# EAGLE design wet_spinning_pcb_v3 (EAGLE 9.6.2)
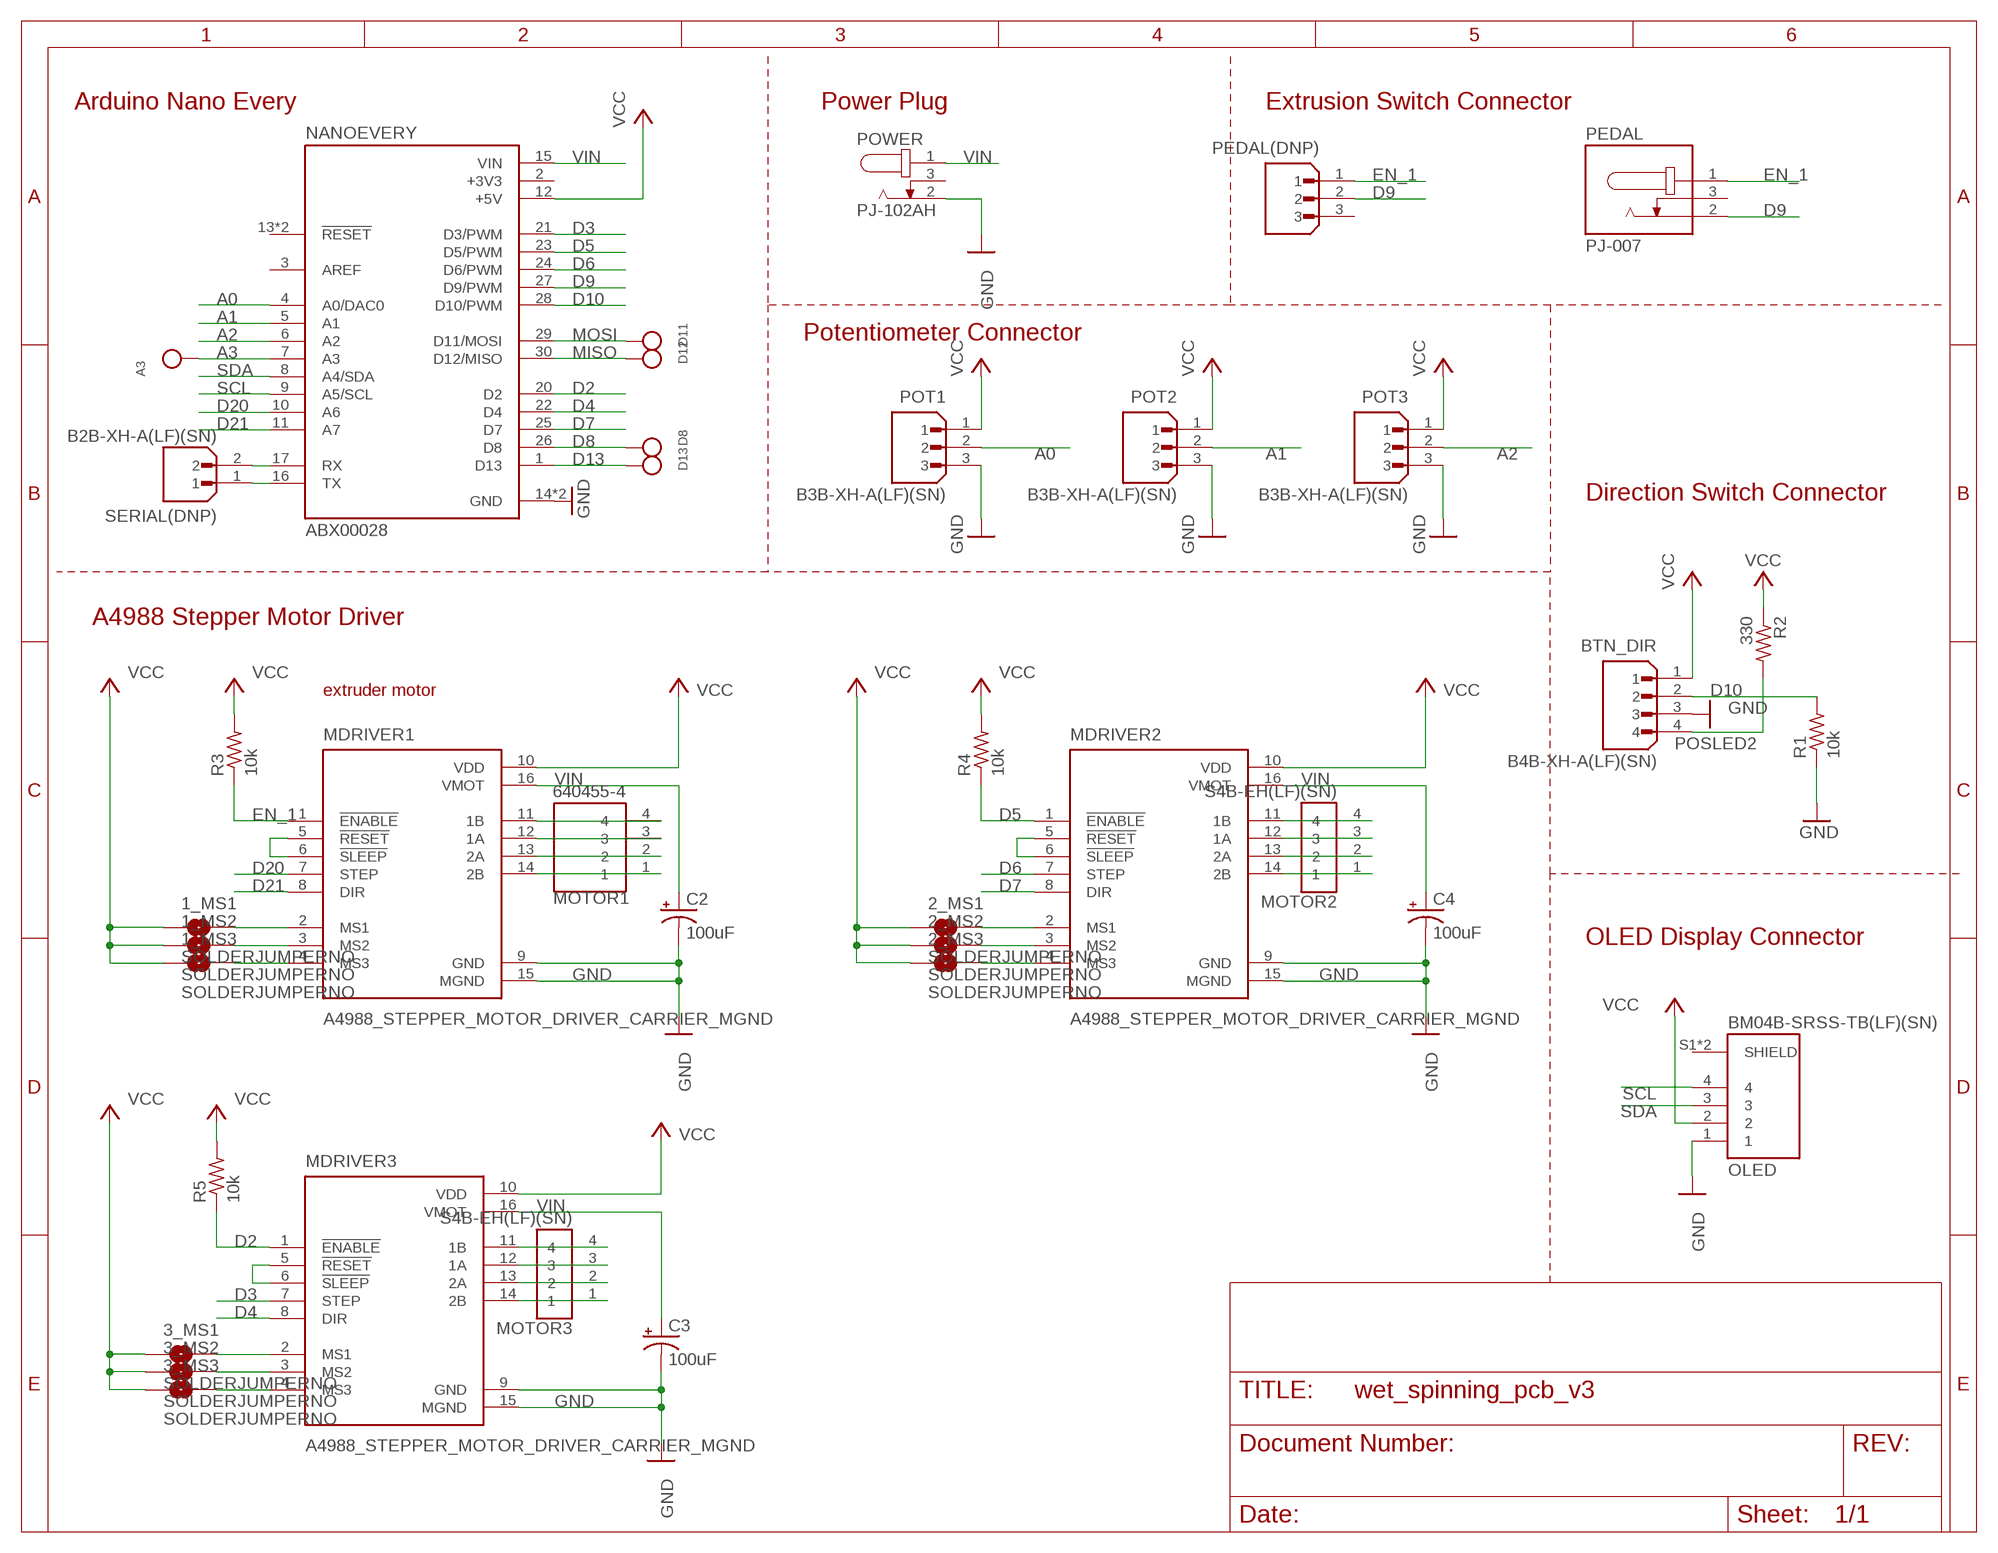
[diagram p0: schematic, sheet 1]

## Parts
1_MS1  SOLDERJUMPERNO  [SJ_2S-NO]
1_MS2  SOLDERJUMPERNO  [SJ_2S-NO]
1_MS3  SOLDERJUMPERNO  [SJ_2S-NO]
2_MS1  SOLDERJUMPERNO  [SJ_2S-NO]
2_MS2  SOLDERJUMPERNO  [SJ_2S-NO]
2_MS3  SOLDERJUMPERNO  [SJ_2S-NO]
3_MS1  SOLDERJUMPERNO  [SJ_2S-NO]
3_MS2  SOLDERJUMPERNO  [SJ_2S-NO]
3_MS3  SOLDERJUMPERNO  [SJ_2S-NO]
A3  TESTPOINT0.1"  [1X01_ROUND]
BTN_DIR  B4B-XH-A(LF)(SN)  [JST_B4B-XH-A(LF)(SN)]
C2  100uF  100UF-POLAR-RADIAL-2.5MM-25V-20%  [CPOL-RADIAL-2.5MM-6.5MM]
C3  100uF  100UF-POLAR-RADIAL-2.5MM-25V-20%  [CPOL-RADIAL-2.5MM-6.5MM]
C4  100uF  100UF-POLAR-RADIAL-2.5MM-25V-20%  [CPOL-RADIAL-2.5MM-6.5MM]
D8  TESTPOINT0.1"  [1X01_ROUND]
D11  TESTPOINT0.1"  [1X01_ROUND]
D12  TESTPOINT0.1"  [1X01_ROUND]
D13  TESTPOINT0.1"  [1X01_ROUND]
MDRIVER1  A4988_STEPPER_MOTOR_DRIVER_CARRIER_MGND  [MODULE_A4988_STEPPER_MOTOR_DRIVER_CARRIER]
MDRIVER2  A4988_STEPPER_MOTOR_DRIVER_CARRIER_MGND  [MODULE_A4988_STEPPER_MOTOR_DRIVER_CARRIER]
MDRIVER3  A4988_STEPPER_MOTOR_DRIVER_CARRIER_MGND  [MODULE_A4988_STEPPER_MOTOR_DRIVER_CARRIER]
MOTOR1  640455-4  [TE_640455-4]
MOTOR2  S4B-EH(LF)(SN)  [JST_S4B-EH(LF)(SN)]
MOTOR3  S4B-EH(LF)(SN)  [JST_S4B-EH(LF)(SN)]
NANOEVERY  ABX00028  [MODULE_ABX00028]
OLED  BM04B-SRSS-TB(LF)(SN)  [JST_BM04B-SRSS-TB(LF)(SN)]
PEDAL  PJ-007  [CUI_PJ-007]
PEDAL(DNP)  B3B-XH-A(LF)(SN)  [JST_B3B-XH-A(LF)(SN)]
POT1  B3B-XH-A(LF)(SN)  [JST_B3B-XH-A(LF)(SN)]
POT2  B3B-XH-A(LF)(SN)  [JST_B3B-XH-A(LF)(SN)]
POT3  B3B-XH-A(LF)(SN)  [JST_B3B-XH-A(LF)(SN)]
POWER  PJ-102AH  [CUI_PJ-102AH]
R1  10k  R-US_0204/7  [0204/7]
R2  330  R-US_0204/7  [0204/7]
R3  10k  R-US_0204/7  [0204/7]
R4  10k  R-US_0204/7  [0204/7]
R5  10k  R-US_0204/7  [0204/7]
SERIAL(DNP)  B2B-XH-A(LF)(SN)  [JST_B2B-XH-A(LF)(SN)]

## Nets
A0: NANOEVERY.4(A0/DAC0) POT1.2
A1: NANOEVERY.5(A1) POT2.2
A2: NANOEVERY.6(A2) POT3.2
A3: A3.1 NANOEVERY.7(A3)
D2: MDRIVER3.1(!ENABLE) NANOEVERY.20(D2) R5.1
D3: MDRIVER3.7(STEP) NANOEVERY.21(D3/PWM)
D4: MDRIVER3.8(DIR) NANOEVERY.22(D4)
D5: MDRIVER2.1(!ENABLE) NANOEVERY.23(D5/PWM) R4.1
D6: MDRIVER2.7(STEP) NANOEVERY.24(D6/PWM)
D7: MDRIVER2.8(DIR) NANOEVERY.25(D7)
D8: D8.1 NANOEVERY.26(D8)
D9: NANOEVERY.27(D9/PWM) PEDAL(DNP).2 PEDAL.2
D10: BTN_DIR.2 NANOEVERY.28(D10/PWM) R1.2
D13: D13.1 NANOEVERY.1(D13)
D20: MDRIVER1.7(STEP) NANOEVERY.10(A6)
D21: MDRIVER1.8(DIR) NANOEVERY.11(A7)
EN_1: MDRIVER1.1(!ENABLE) PEDAL(DNP).1 PEDAL.1 R3.1
GND: BTN_DIR.3 C2.2(-) C3.2(-) C4.2(-) MDRIVER1.9(GND) MDRIVER1.15(MGND) MDRIVER2.9(GND) MDRIVER2.15(MGND) MDRIVER3.9(GND) MDRIVER3.15(MGND) NANOEVERY.14(GND) NANOEVERY.19(GND) OLED.1 POT1.3 POT2.3 POT3.3 POWER.2 R1.1
MISO: D12.1 NANOEVERY.30(D12/MISO)
MOSI: D11.1 NANOEVERY.29(D11/MOSI)
N$1: MDRIVER1.12(1A) MOTOR1.3
N$2: MDRIVER1.11(1B) MOTOR1.4
N$3: MDRIVER3.14(2B) MOTOR3.1
N$4: MDRIVER3.13(2A) MOTOR3.2
N$5: MDRIVER1.5(!RESET) MDRIVER1.6(!SLEEP)
N$6: MDRIVER3.5(!RESET) MDRIVER3.6(!SLEEP)
N$7: MDRIVER2.5(!RESET) MDRIVER2.6(!SLEEP)
N$8: 1_MS1.2 MDRIVER1.2(MS1)
N$9: MDRIVER1.14(2B) MOTOR1.1
N$10: MDRIVER1.13(2A) MOTOR1.2
N$11: 1_MS2.2 MDRIVER1.3(MS2)
N$12: 1_MS3.2 MDRIVER1.4(MS3)
N$13: MDRIVER3.12(1A) MOTOR3.3
N$14: MDRIVER3.11(1B) MOTOR3.4
N$15: MDRIVER2.14(2B) MOTOR2.1
N$16: MDRIVER2.13(2A) MOTOR2.2
N$17: MDRIVER2.12(1A) MOTOR2.3
N$18: MDRIVER2.11(1B) MOTOR2.4
N$19: NANOEVERY.16(TX) SERIAL(DNP).1
N$20: NANOEVERY.17(RX) SERIAL(DNP).2
N$21: 2_MS1.2 MDRIVER2.2(MS1)
N$22: 2_MS2.2 MDRIVER2.3(MS2)
N$23: 2_MS3.2 MDRIVER2.4(MS3)
N$24: 3_MS1.2 MDRIVER3.2(MS1)
N$25: 3_MS2.2 MDRIVER3.3(MS2)
N$26: 3_MS3.2 MDRIVER3.4(MS3)
POSLED2: BTN_DIR.4 R2.2
SCL: NANOEVERY.9(A5/SCL) OLED.4
SDA: NANOEVERY.8(A4/SDA) OLED.3
VCC: 1_MS1.1 1_MS2.1 1_MS3.1 2_MS1.1 2_MS2.1 2_MS3.1 3_MS1.1 3_MS2.1 3_MS3.1 BTN_DIR.1 MDRIVER1.10(VDD) MDRIVER2.10(VDD) MDRIVER3.10(VDD) NANOEVERY.12(+5V) OLED.2 POT1.1 POT2.1 POT3.1 R2.1 R3.2 R4.2 R5.2
VIN: C2.1(+) C3.1(+) C4.1(+) MDRIVER1.16(VMOT) MDRIVER2.16(VMOT) MDRIVER3.16(VMOT) NANOEVERY.15(VIN) POWER.1
Unconnected: NANOEVERY.3(AREF) NANOEVERY.13(!RESET) NANOEVERY.18(!RESET) OLED.S1(SHIELD) OLED.S2(SHIELD) PEDAL(DNP).3 PEDAL.3 POWER.3

## Notes on the sheet
- Arduino Nano Every | Power Plug | Extrusion Switch Connector
- Potentiometer Connector
- Direction Switch Connector
- A4988 Stepper Motor Driver
- extruder motor
- OLED Display Connector

## Power pins joined to a net without a drawn wire
+3V3: NANOEVERY.2(+3V3)

## Library data of the parts
1_MS1-1_MS3 2_MS1-2_MS3 3_MS1-3_MS3 = SparkFun-Retired:SOLDERJUMPER: Solder Jumper Standard SMD solder jumper. Used to automate production. Two varients : Normally Open and Normally Closed are the same, but have different paste layers. NC will have a large amount of paste and should jumper during reflow.
A3 D8 D11-D13 = microbuilder:TESTPOINT: Test Point Various test points for characterisation and PCB testing TESTPOINT_SMT - Compact Surface Mount Test Point [Digikey: 5016KTR-ND]; BOM: EXCLUDE
BTN_DIR = HBL:B4B-XH-A(LF)(SN): Check availability <https://pricing.snapeda.com/parts/B4B-XH-A%28LF%29%28SN%29/JST%20Sales/view-part?ref=eda>; AVAILABILITY: In Stock; CHECK_PRICES: https://www.snapeda.com/parts/B4B-XH-A(LF)(SN)/JST+Sales+America+Inc./view-part/?ref=eda; DESCRIPTION: Connector Header Through Hole 4 position 0.098 (2.50mm); MF: JST Sales; MP: B4B-XH-A(LF)(SN); PACKAGE: None; PRICE: None; SNAPEDA_LINK: https://www.snapeda.com/parts/B4B-XH-A(LF)(SN)/JST+Sales+America+Inc./view-part/?ref=snap
C2-C4 = SparkFun-Capacitors:100UF-POLAR: 100µF polarized capacitors A capacitor is a passive two-terminal electrical component used to store electrical energy temporarily in an electric field.; PROD_ID: CAP-08439
MDRIVER1-MDRIVER3 = HBL:A4988_STEPPER_MOTOR_DRIVER_CARRIER_MGND
MOTOR1 = HBL:640455-4: Check availability <https://pricing.snapeda.com/parts/640455-4/TE%20Connectivity/view-part?ref=eda>; AVAILABILITY: In Stock; CENTERLINE_PITCH: 2.54 mm[.1 in]; CHECK_PRICES: https://www.snapeda.com/parts/640455-4/TE+Connectivity+AMP+Connectors/view-part/?ref=eda; COMMENT: 640455-4; DESCRIPTION: MTA-100 HEADER - TIN, 04P MTA100 HDR ASSY SQ R/A POL | TE Connectivity 640455-4; MF: TE Connectivity; MP: 640455-4; NUMBER_OF_POSITIONS: 4; PACKAGE: None; PRICE: None; PRODUCT_TYPE: Connector; SNAPEDA_LINK: https://www.snapeda.com/parts/640455-4/TE+Connectivity+AMP+Connectors/view-part/?ref=snap
MOTOR2 MOTOR3 = HBL:S4B-EH(LF)(SN): Check availability <https://pricing.snapeda.com/parts/S4B-EH%28LF%29%28SN%29/JST%20Sales/view-part?ref=eda>; AVAILABILITY: In Stock; CHECK_PRICES: https://www.snapeda.com/parts/S4B-EH(LF)(SN)/JST/view-part/?ref=eda; DESCRIPTION: Connector Header Through Hole, Right Angle 4 position 0.098 (2.50mm); MF: JST Sales; MP: S4B-EH(LF)(SN); PACKAGE: None; PRICE: None; SNAPEDA_LINK: https://www.snapeda.com/parts/S4B-EH(LF)(SN)/JST/view-part/?ref=snap
NANOEVERY = HBL:ABX00028: ATmega4809 Arduino Nano Every AVR AVR MCU 8-Bit Embedded Evaluation Board Check availability <https://pricing.snapeda.com/parts/Arduino%20Nano%20Every/Arduino/view-part?ref=eda>; AVAILABILITY: Not in stock; CHECK_PRICES: https://www.snapeda.com/parts/Arduino%20Nano%20Every/Arduino/view-part/?ref=eda; DESCRIPTION: Arduino’s 5V compatible board in the smallest available form factor: 45x18mm!; MF: Arduino; MP: Arduino Nano Every; PACKAGE: None; PRICE: None; SNAPEDA_LINK: https://www.snapeda.com/parts/Arduino%20Nano%20Every/Arduino/view-part/?ref=snap
OLED = HBL:BM04B-SRSS-TB(LF)(SN): Check availability <https://pricing.snapeda.com/parts/BM04B-SRSS-TB%28LF%29%28SN%29/JST%20Sales/view-part?ref=eda>; AVAILABILITY: In Stock; CHECK_PRICES: https://www.snapeda.com/parts/BM04B-SRSS-TB(LF)(SN)/JST+Sales+America+Inc./view-part/?ref=eda; DESCRIPTION: Connector Header Surface Mount 4 position 0.039 (1.00mm); MF: JST Sales; MP: BM04B-SRSS-TB(LF)(SN); PACKAGE: None; PRICE: None; SNAPEDA_LINK: https://www.snapeda.com/parts/BM04B-SRSS-TB(LF)(SN)/JST+Sales+America+Inc./view-part/?ref=snap
PEDAL = HBL:PJ-007: Check availability <https://pricing.snapeda.com/parts/PJ-007/Same%20Sky/view-part?ref=eda>; AVAILABILITY: In Stock; CHECK_PRICES: https://www.snapeda.com/parts/PJ-007/Same+Sky/view-part/?ref=eda; DESCRIPTION: 1.3 x 4.2 mm, 2.0 A, Horizontal, Through Hole, Dc Power Jack Connector; MF: Same Sky; MP: PJ-007; PACKAGE: None; PRICE: None; SNAPEDA_LINK: https://www.snapeda.com/parts/PJ-007/Same+Sky/view-part/?ref=snap
PEDAL(DNP) = HBL:B3B-XH-A(LF)(SN): Check availability <https://pricing.snapeda.com/parts/B3B-XH-A%28LF%29%28SN%29/JST%20Sales/view-part?ref=eda>; AVAILABILITY: In Stock; CHECK_PRICES: https://www.snapeda.com/parts/B3B-XH-A(LF)(SN)/JST+Sales+America+Inc./view-part/?ref=eda; DESCRIPTION: Connector Header Through Hole 3 position 0.098 (2.50mm); MF: JST Sales; MP: B3B-XH-A(LF)(SN); PACKAGE: None; PRICE: None; SNAPEDA_LINK: https://www.snapeda.com/parts/B3B-XH-A(LF)(SN)/JST+Sales+America+Inc./view-part/?ref=snap; SPICEPREFIX: J
POT1-POT3 = HBL:B3B-XH-A(LF)(SN): Check availability <https://pricing.snapeda.com/parts/B3B-XH-A%28LF%29%28SN%29/JST%20Sales/view-part?ref=eda>; AVAILABILITY: In Stock; CHECK_PRICES: https://www.snapeda.com/parts/B3B-XH-A(LF)(SN)/JST+Sales+America+Inc./view-part/?ref=eda; DESCRIPTION: Connector Header Through Hole 3 position 0.098 (2.50mm); MF: JST Sales; MP: B3B-XH-A(LF)(SN); PACKAGE: None; PRICE: None; SNAPEDA_LINK: https://www.snapeda.com/parts/B3B-XH-A(LF)(SN)/JST+Sales+America+Inc./view-part/?ref=snap
POWER = HBL:PJ-102AH: 2.0 mm Center Pin, 5.0 A, Right Angle, Through Hole, Tapered Pins, Dc Power Jack Connector; MANUFACTURER: CUI INC; PART_REV: 1.02; STANDARD: Manufacturer recommendations
R1-R5 = rcl:R-US_: RESISTOR, American symbol; SPICEPREFIX: R
SERIAL(DNP) = HBL:B2B-XH-A(LF)(SN): Check availability <https://pricing.snapeda.com/parts/B2B-XH-A%28LF%29%28SN%29/JST%20Sales/view-part?ref=eda>; AVAILABILITY: In Stock; CHECK_PRICES: https://www.snapeda.com/parts/B2B-XH-A(LF)(SN)/JST+Sales+America+Inc./view-part/?ref=eda; DESCRIPTION: Connector Header Through Hole 2 position 0.098 (2.50mm); MF: JST Sales; MP: B2B-XH-A(LF)(SN); PACKAGE: None; PRICE: None; SNAPEDA_LINK: https://www.snapeda.com/parts/B2B-XH-A(LF)(SN)/JST+Sales+America+Inc./view-part/?ref=snap

## Board
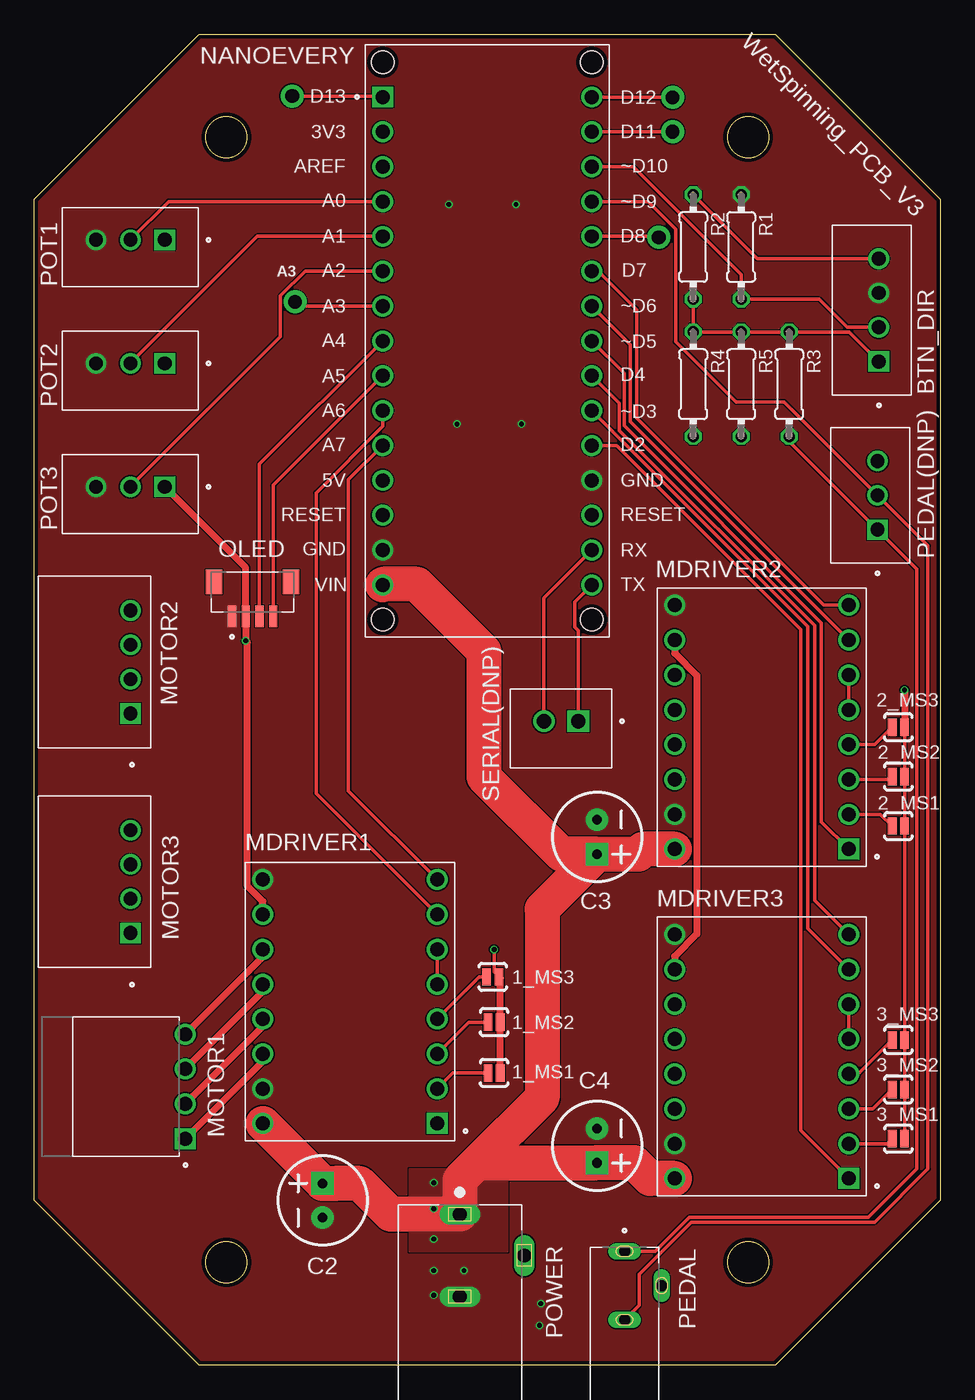
[diagram p1: board, top side]
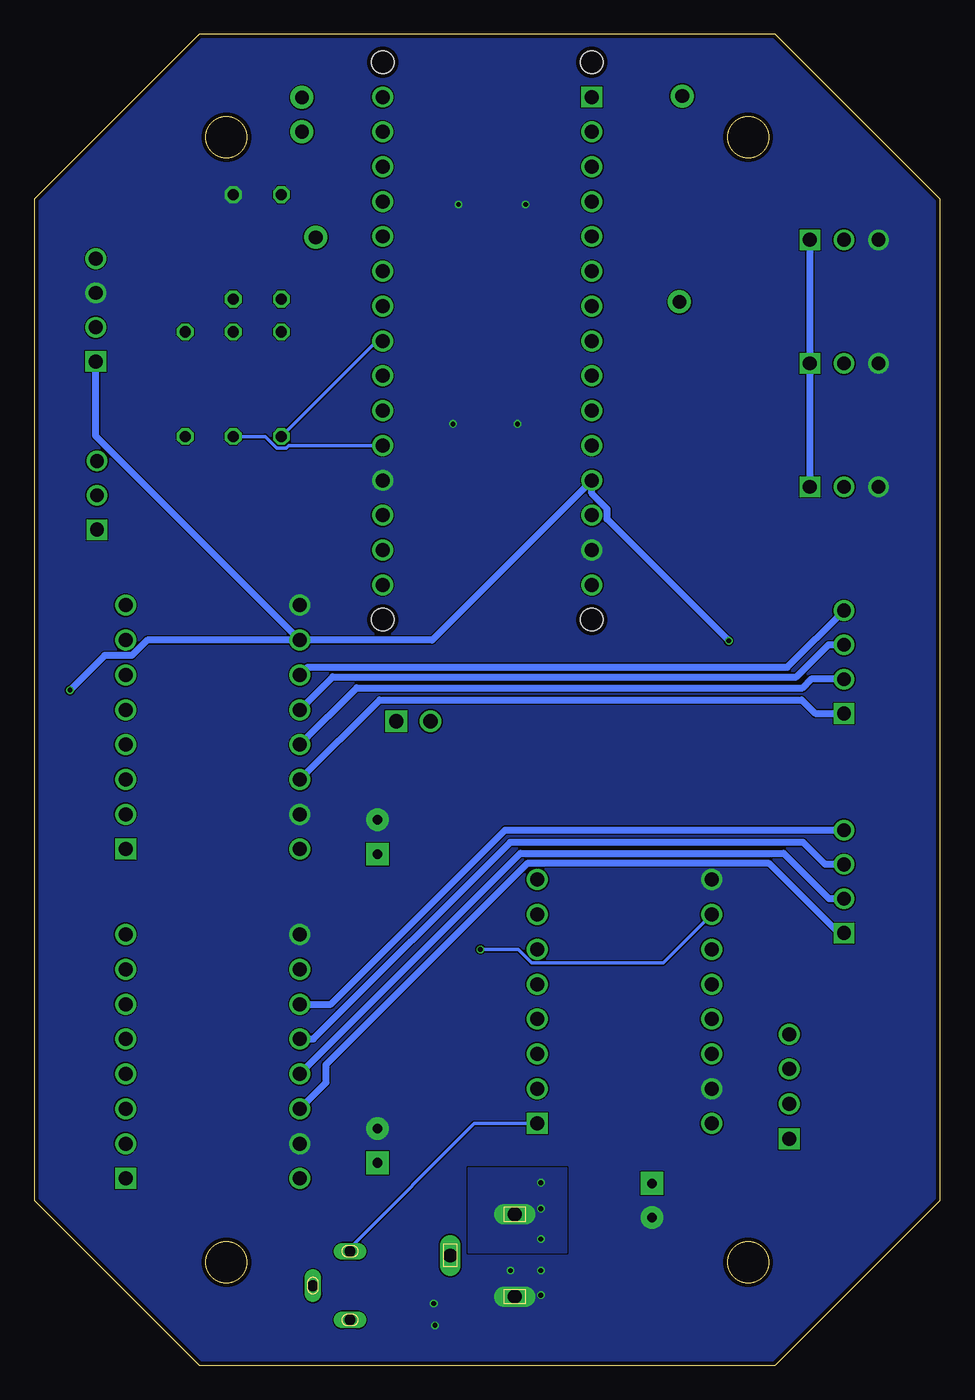
[diagram p2: board, bottom side, seen from below]

Size 66 x 97 mm. Coordinates in mm from the lower left corner, seen from the top.
Outline: 0,85 12,97 54,97 66,85 66,12 54,0 12,0 0,12 0,85
Outline: circle at 14,89.5 radius 1.5
Outline: circle at 52,89.5 radius 1.5
Outline: circle at 52,7.5 radius 1.5
Outline: circle at 14,7.5 radius 1.5
Copper layers (1*16): Top 0.035mm / dielectric 1.5mm / Bottom 0.035mm
Design rules "PCBWay_2L_100um-Track": minimum track width 0.1mm, minimum drill 0.3mm, track to track 0.1mm, track to pad 0.1mm, pad to pad 0.1mm, via to via 0.1mm, smd to smd 0mil, copper to edge 0.3mm, drill to drill 10mil, minimum pad ring 6mil, minimum via ring 0.1mm, stop-mask expansion 2mil, vias tented up to drill 0.45mm, thermal gap 0.2mm
tKeepout: area 11.5,87 to 16.5,92; area 49.5,87 to 54.5,92; area 11.5,5 to 16.5,10; area 49.5,5 to 54.5,10

### Footprints (pad centres in the part's own frame; a part is rotated, then mirrored left to right if it is on the bottom)
SJ_2S-NO = smd 0.635 x 1.27: 1 -0.45,0; 2 0.45,0
1X01_ROUND = drill 1 pad 1.676: 1 0,0
JST_B4B-XH-A(LF)(SN) = drill 1 square: 1 -3.75,-0.525 | drill 1: 2 -1.25,-0.525; 3 1.25,-0.525; 4 3.75,-0.525
CPOL-RADIAL-2.5MM-6.5MM = drill 0.7 pad 1.651 square: 1 1.25,0 | drill 0.7 pad 1.651: 2 -1.25,0
MODULE_A4988_STEPPER_MOTOR_DRIVER_CARRIER = drill 1.02 square: 1 -6.35,8.89 | drill 1.02: 2 -6.35,6.35; 3 -6.35,3.81; 4 -6.35,1.27; 5 -6.35,-1.27; 6 -6.35,-3.81; 7 -6.35,-6.35; 8 -6.35,-8.89; 9 6.35,-8.89; 10 6.35,-6.35; 11 6.35,-3.81; 12 6.35,-1.27; 13 6.35,1.27; 14 6.35,3.81; 15 6.35,6.35; 16 6.35,8.89
TE_640455-4 = drill 1.02 pad 1.37 square: 1 0,0 | drill 1.02 pad 1.37: 2 -2.54,0; 3 -5.08,0; 4 -7.62,0
JST_S4B-EH(LF)(SN) = drill 1 pad 1.5 square: 1 0,0 | drill 1 pad 1.5: 2 2.5,0; 3 5,0; 4 7.5,0
MODULE_ABX00028 = drill 1.016 square: 1 -17.78,-7.62 | drill 1.016: 2 -15.24,-7.62; 3 -12.7,-7.62; 4 -10.16,-7.62; 5 -7.62,-7.62; 6 -5.08,-7.62; 7 -2.54,-7.62; 8 0,-7.62; 9 2.54,-7.62; 10 5.08,-7.62; 11 7.62,-7.62; 12 10.16,-7.62; 13 12.7,-7.62; 14 15.24,-7.62; 15 17.78,-7.62; 16 17.78,7.62; 17 15.24,7.62; 18 12.7,7.62; 19 10.16,7.62; 20 7.62,7.62; 21 5.08,7.62; 22 2.54,7.62; 23 0,7.62; 24 -2.54,7.62; 25 -5.08,7.62; 26 -7.62,7.62; 27 -10.16,7.62; 28 -12.7,7.62; 29 -15.24,7.62; 30 -17.78,7.62 | hole 1.651: -20.32,-7.62; -20.32,7.62; 20.32,7.62; 20.32,-7.62
JST_BM04B-SRSS-TB(LF)(SN) = smd 0.6 x 1.55: 1 -1.5,-2.525; 2 -0.5,-2.525; 3 0.5,-2.525; 4 1.5,-2.525 | smd 1.2 x 1.8: S1 -2.8,0; S2 2.8,0
CUI_PJ-007 = drill 0.8 pad 1.2 long: 1 0,0; 2 5,0; 3 2.5,2.7
JST_B3B-XH-A(LF)(SN) = drill 1 square: 1 -2.5,-0.525 | drill 1: 2 0,-0.525; 3 2.5,-0.525
CUI_PJ-102AH = drill 1 long: 1 -6.5,0; 2 -0.5,0; 3 -3.5,4.7
0204/7 = drill 0.813 octagon: 1 -3.81,0; 2 3.81,0
JST_B2B-XH-A(LF)(SN) = drill 1.05 square: 1 -1.25,-0.525 | drill 1.05: 2 1.25,-0.525

### Placement (x,y rotation side)
1_MS1  33.5,21.3 180 top
1_MS2  33.5,25 180 top
1_MS3  33.4,28.3 180 top
2_MS1  62.95,39.3 180 top
2_MS2  62.95,42.9 180 top
2_MS3  62.95,46.5 180 top
3_MS1  62.95,16.5 180 top
3_MS2  62.95,20.1 180 top
3_MS3  62.95,23.7 180 top
A3  19,77.5 0 top
BTN_DIR  61,76.9 90 top
C2  21,12 90 top
C3  41,38.5 270 top
C4  41,16 270 top
D8  45.5,82.2 0 top
D11  46.5,89.9 0 top
D12  46.5,92.4 0 top
D13  18.8,92.5 0 top
MDRIVER1  23,26.5 180 top
MDRIVER2  53,46.5 180 top
MDRIVER3  53,22.5 180 top
MOTOR1  11,16.5 270 top
MOTOR2  7,47.5 90 top
MOTOR3  7,31.5 90 top
NANOEVERY  33,74.65 270 top
OLED  15.9,57.1 0 top
PEDAL  43,8.3 270 top
PEDAL(DNP)  60.9,63.4 90 top
POT1  7,81.5 180 top
POT2  7,72.5 180 top
POT3  7,63.5 180 top
POWER  31,4.5 270 top
R1  51.5,81.5 270 top
R2  48,81.5 90 top
R3  55,71.5 90 top
R4  48,71.5 90 top
R5  51.5,71.5 90 top
SERIAL(DNP)  38.38,46.41 180 top

### Tracks (layer width: path | path; a pad name or v marks a point on that pad's centre or on a via)
A0
  Top 0.254: NANOEVERY.4 9.79,84.81 POT1.2
A1
  Top 0.254: NANOEVERY.5 16.25,82.27 POT2.2
A2
  Top 0.254: POT3.2 17.94,74.96 17.94,77.94 19.72,79.73 NANOEVERY.6
A3
  Top 0.254: NANOEVERY.7 19.31,77.19 A3.1
D2
  Top 0.254: MDRIVER3.1 55.85,17.11 55.85,53.6 42.42,67.03 NANOEVERY.20
  Bottom 0.254: R5.1 49.18,67.69 48.35,66.85 47.65,66.85 47.48,67.03 NANOEVERY.20
D3
  Top 0.254: MDRIVER3.7 56.35,31.85 56.35,53.84 NANOEVERY.21
D4
  Top 0.254: MDRIVER3.8 56.85,33.89 56.85,53.89 42.63,68.12 42.63,70.1 NANOEVERY.22
D5
  Top 0.254: MDRIVER2.1 57.35,39.61 57.35,54.11 42.98,68.48 42.98,72.29 NANOEVERY.23
  Bottom 0.254: R4.1 41.04,74.65 NANOEVERY.23
D6
  Top 0.254: MDRIVER2.7 43.42,68.78 43.42,74.39 NANOEVERY.24
D7
  Top 0.254: MDRIVER2.8 57.52,55.39 43.89,69.02 43.89,76.92 41.08,79.73 NANOEVERY.25
D8
  Top 0.254: NANOEVERY.26 45.43,82.27 D8.1
D9
  Top 0.254: NANOEVERY.27 44.72,84.81 46.73,82.8 46.73,74.6 51.12,70.2 54.62,70.2 PEDAL(DNP).2 65.1,59.73 65.1,14.3 61.22,10.42 47.85,10.42 44.07,6.64 44.07,4.37 PEDAL.2
D10
  Top 0.254: BTN_DIR.2 59.23,75.65 57.19,77.69 R1.2 51.5,79.49 43.64,87.35 NANOEVERY.28
D13
  Top 0.254: D13.1 25.31,92.5 NANOEVERY.1
D20
  Top 0.254: NANOEVERY.10 25.38,68.43 20.53,63.58 20.53,41.67 MDRIVER1.7
D21
  Top 0.254: NANOEVERY.11 22.88,64.53 22.88,41.86 MDRIVER1.8
EN_1
  Top 0.254: R3.1 55,67.33 PEDAL(DNP).1 64.3,58.02 64.3,14.3 60.77,10.77 47.7,10.77 45.23,8.3 PEDAL.1
  Bottom 0.254: PEDAL.1 43,8.56 33.95,17.61 MDRIVER1.1
GND  (via drill 0.35)
  other vias: 31.3,6.9 29.1,6.9 29.1,5.1 36.9,4.5 36.8,2.9 30.8,68.6 35.5,68.6 30.2,84.6 35.1,84.6
  pour Top (rank 2, no thermals): -4,98.5 70,98.5 70,-2.7 -4,-2.7
  pour Bottom (rank 2, no thermals): -2,100.5 -2,-4.3 72,-4.3 72,100.5
MISO
  Top 0.254: NANOEVERY.30 46.47,92.43 D12.1
MOSI
  Top 0.254: NANOEVERY.29 D11.1
N$1
  Top 0.508: MOTOR1.3 16.65,27.23 MDRIVER1.12
N$2
  Top 0.508: MOTOR1.4 16.65,29.77 MDRIVER1.11
N$3
  Bottom 0.508: MOTOR3.1 7.4,31.5 12.5,36.6 30.04,36.6 44.75,21.89 44.75,20.59 MDRIVER3.14
N$4
  Bottom 0.508: MOTOR3.2 8.1,34 11.4,37.3 30.58,37.3 MDRIVER3.13
N$5
  Top 0.254: MDRIVER1.5 MDRIVER1.6
N$6
  Top 0.254: MDRIVER3.5 MDRIVER3.6
N$7
  Top 0.254: MDRIVER2.5 MDRIVER2.6
N$8
  Top 0.254: MDRIVER1.2 30.5,21.3 1_MS1.2
N$9
  Top 0.508: MOTOR1.1 16.65,22.15 MDRIVER1.14
N$10
  Top 0.508: MOTOR1.2 16.65,24.69 MDRIVER1.13
N$11
  Top 0.254: MDRIVER1.3 31.66,25 1_MS2.2
N$12
  Top 0.254: MDRIVER1.4 32.42,28.3 1_MS3.2
N$13
  Bottom 0.508: MOTOR3.3 8.38,36.5 9.99,38.11 31.33,38.11 45.67,23.77 MDRIVER3.12
N$14
  Bottom 0.508: MDRIVER3.11 44.39,26.31 31.7,39 MOTOR3.4
N$15
  Bottom 0.508: MDRIVER2.14 40.84,48.5 10.1,48.5 9.1,47.5 MOTOR2.1
N$16
  Bottom 0.508: MDRIVER2.13 42.51,49.37 10.03,49.37 9.4,50 MOTOR2.2
N$17
  Bottom 0.508: MOTOR2.3 8.14,52.5 10.48,50.16 44.26,50.16 MDRIVER2.12
N$18
  Bottom 0.508: MDRIVER2.11 46.09,50.87 11.13,50.87 MOTOR2.4
N$19
  Top 0.254: SERIAL(DNP).1 39.63,53.55 39.37,53.81 39.37,55.62 NANOEVERY.16
N$20
  Top 0.254: NANOEVERY.17 37.13,55.92 SERIAL(DNP).2
N$21
  Top 0.254: MDRIVER2.2 61.65,40.15 2_MS1.2
N$22
  Top 0.254: MDRIVER2.3 62.29,42.69 2_MS2.2
N$23
  Top 0.254: MDRIVER2.4 61.23,45.23 2_MS3.2
N$24
  Top 0.254: MDRIVER3.2 62.15,16.15 3_MS1.2
N$25
  Top 0.254: MDRIVER3.3 61.09,18.69 3_MS2.2
N$26
  Top 0.254: MDRIVER3.4 60.03,21.23 3_MS3.2
POSLED2
  Top 0.254: BTN_DIR.4 52.66,80.65 R2.2
SCL
  Top 0.254: NANOEVERY.9 17.4,64.13 OLED.4
SDA
  Top 0.254: NANOEVERY.8 16.4,65.67 OLED.3
VCC  (via drill 0.35)
  Top 0.254: 3_MS1.1 3_MS2.1 3_MS3.1 2_MS1.1 2_MS2.1 63.4,46.2 2_MS3.1 | R2.1 R4.2 R5.2 R3.2 59.06,75.31 59.08,75.3 59.38,75.3 BTN_DIR.1 | 1_MS3.1 33.5,28.65 v33.5,30.3
  Top 0.508: 1_MS1.1 1_MS2.1 33.95,28.2 1_MS3.1 | v63.4,49.2 63.4,46.2 | MDRIVER2.10 46.65,51.89 48.27,50.27 48.27,31.43 46.65,29.81 MDRIVER3.10 | MDRIVER1.10 16.65,33.81 15.53,34.93 15.53,52.67 v15.4,52.8 OLED.2 15.4,58.12 POT3.1
  Bottom 0.254: v33.5,30.3 30.74,30.3 29.76,29.32 20.18,29.32 MDRIVER1.10
  Bottom 0.508: MDRIVER2.10 37.02,52.85 NANOEVERY.12 25.38,63.53 24.26,62.41 24.26,61.66 v15.4,52.8 | MDRIVER2.10 61.52,67.72 BTN_DIR.1 | MDRIVER2.10 57.77,52.85 58.89,51.73 60.87,51.73 v63.4,49.2 | POT1.1 POT2.1 POT3.1
VIN  (via drill 0.35)
  Top 2.54: C3.1 37,33.25 37,19.5 32.25,14.75 | 32.25,14.75 31,13.5 POWER.1 25.95,11 23.71,13.24 21.91,13.24 21.9,13.25 C2.1 | 32.25,14.75 C4.1 43.71,14.76 44.85,13.61 MDRIVER3.16 | NANOEVERY.15 25.44,56.92 27.87,56.92 32.76,52.03 32.76,42.88 38.39,37.25 C3.1 | C2.1 | MDRIVER1.16 C2.1 | C3.1 44.01,37.26 44.37,37.61 MDRIVER2.16
  other vias: 29.1,11.4 29.1,13.3 29.1,9.2
  pour Top (no thermals): 27.3,8.25 34.5,8.25 34.5,14.3 27.3,14.3
  pour Bottom (no thermals): 27.2,14.4 27.2,8.2 34.4,8.2 34.4,14.4

### Text on the board
tNames: D13 | D12 | 3V3 | D11 | AREF | ~D10 | A0 | ~D9 | WetSpinning_PCB_V3 | A1 | D8 | A2 | D7 | A3 | ~D6 | A4 | ~D5 | A5 | D4 | A6 | ~D3 | A7 | D2 | 5V | GND | RESET | RESET | GND | RX | VIN | TX